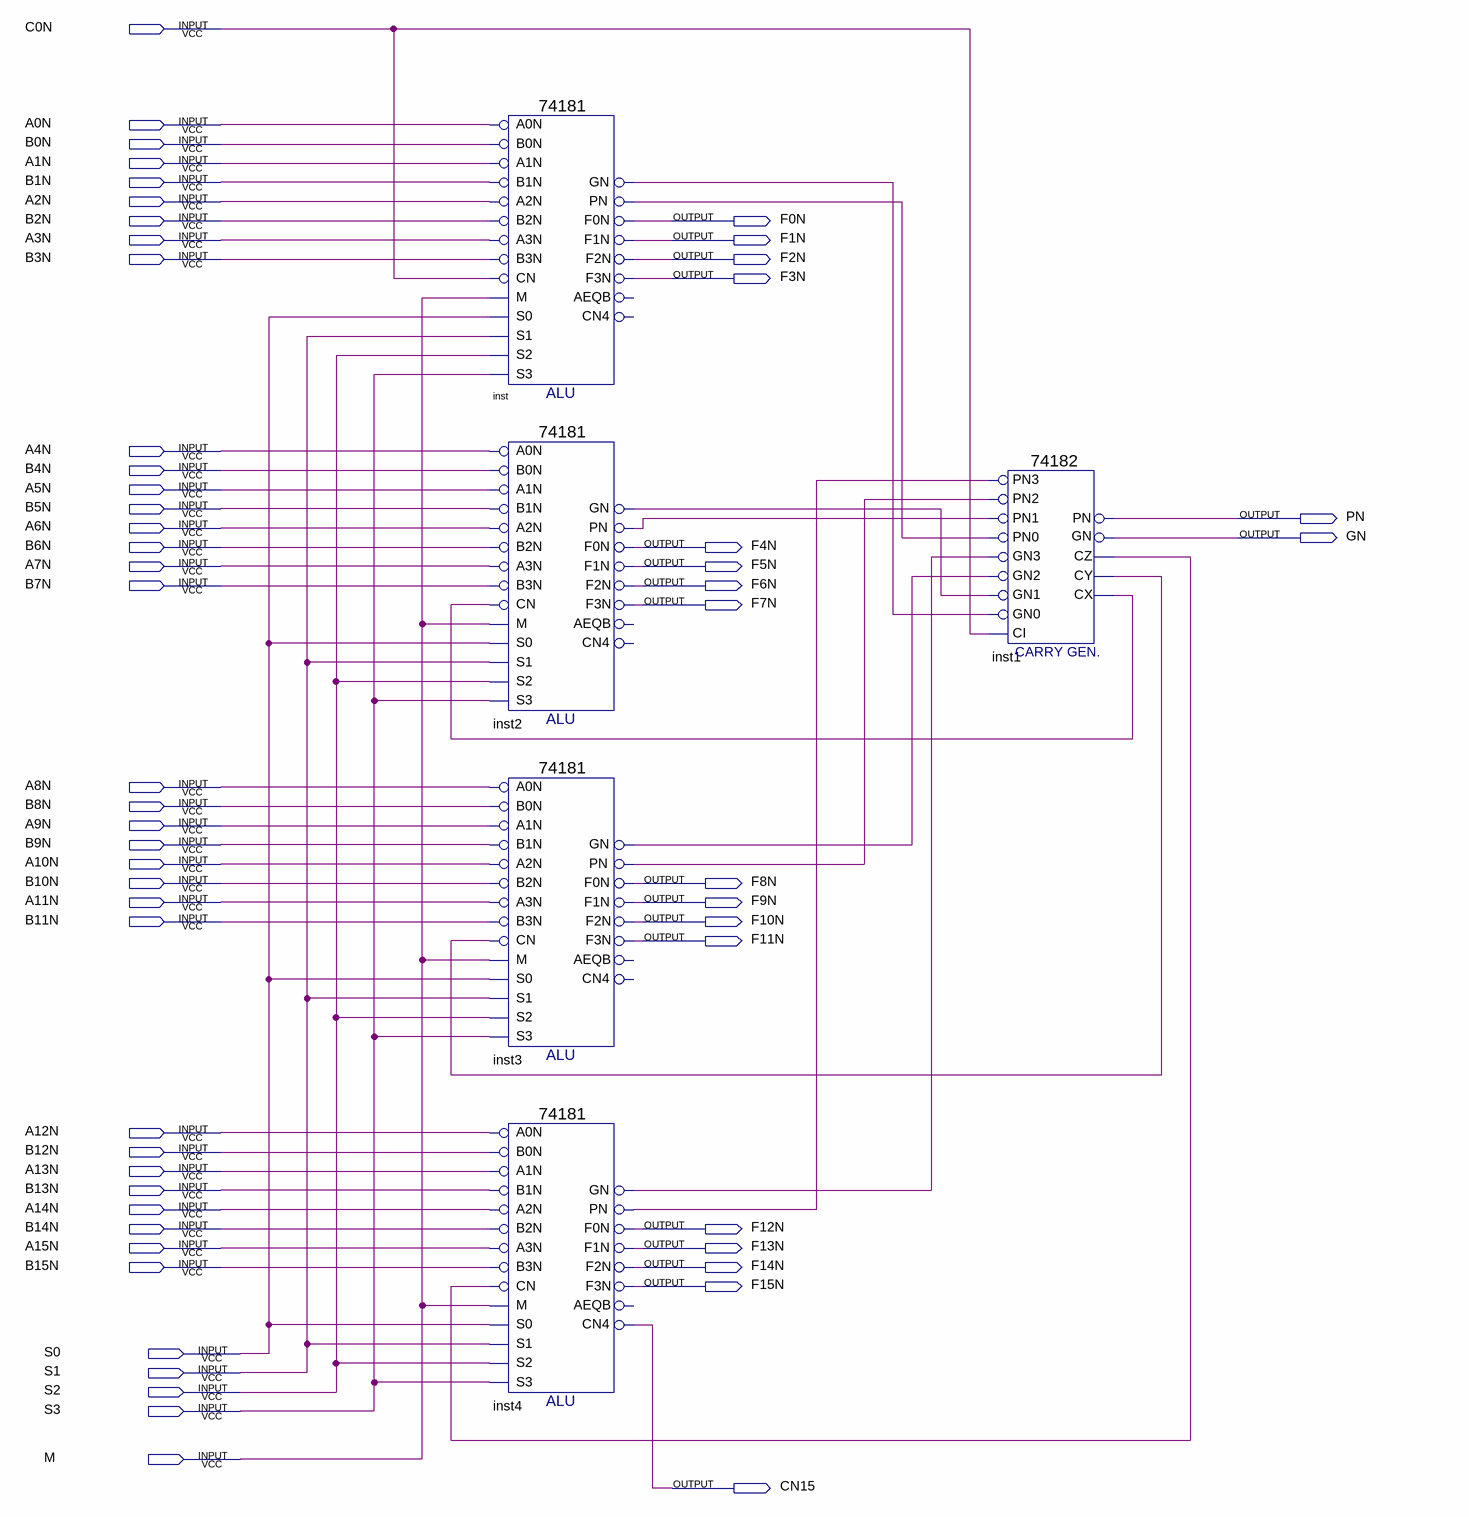
[diagram p0: schematic sheet]
// Quartus schematic ALU-16.bdf as structural Verilog: 5 symbols, 57 pins
module \ALU-16  (
  input  C0N,
  input  A0N,
  input  B0N,
  input  A1N,
  input  B1N,
  input  A2N,
  input  B2N,
  input  A3N,
  input  B3N,
  input  A4N,
  input  B4N,
  input  A5N,
  input  B5N,
  input  A6N,
  input  B6N,
  input  A7N,
  input  B7N,
  input  A8N,
  input  B8N,
  input  A9N,
  input  B9N,
  input  A10N,
  input  B10N,
  input  A11N,
  input  B11N,
  input  A12N,
  input  B12N,
  input  A13N,
  input  B13N,
  input  A14N,
  input  B14N,
  input  A15N,
  input  B15N,
  input  S0,
  input  S1,
  input  S2,
  input  S3,
  input  M,
  output F0N,
  output F1N,
  output F2N,
  output F3N,
  output PN,
  output GN,
  output F4N,
  output F5N,
  output F6N,
  output F7N,
  output F8N,
  output F9N,
  output F10N,
  output F11N,
  output F12N,
  output F13N,
  output F14N,
  output F15N,
  output CN15
);

  wire inst1_cx, inst1_cy, inst1_cz, inst2_gn, inst2_pn, inst3_gn, inst3_pn, inst4_gn, inst4_pn, inst_gn,
       inst_pn;

  \74181  inst (
    .B0N(B0N), .A0N(A0N), .A1N(A1N), .B1N(B1N), .A3N(A3N), .B2N(B2N), .A2N(A2N), .M(M), .CN(C0N), .B3N(B3N),
    .S2(S2), .S1(S1), .S0(S0), .S3(S3), .PN(inst_pn), .GN(inst_gn), .F3N(F3N), .F1N(F1N), .F0N(F0N), .F2N(F2N));  // open: AEQB, CN4
  \74181  inst2 (
    .B0N(B4N), .A0N(A4N), .A1N(A5N), .B1N(B5N), .A3N(A7N), .B2N(B6N), .A2N(A6N), .M(M), .CN(inst1_cx),
    .B3N(B7N), .S2(S2), .S1(S1), .S0(S0), .S3(S3), .PN(inst2_pn), .GN(inst2_gn), .F3N(F7N), .F1N(F5N),
    .F0N(F4N), .F2N(F6N));  // open: AEQB, CN4
  \74181  inst3 (
    .B0N(B8N), .A0N(A8N), .A1N(A9N), .B1N(B9N), .A3N(A11N), .B2N(B10N), .A2N(A10N), .M(M), .CN(inst1_cy),
    .B3N(B11N), .S2(S2), .S1(S1), .S0(S0), .S3(S3), .PN(inst3_pn), .GN(inst3_gn), .F3N(F11N), .F1N(F9N),
    .F0N(F8N), .F2N(F10N));  // open: AEQB, CN4
  \74181  inst4 (
    .B0N(B12N), .A0N(A12N), .A1N(A13N), .B1N(B13N), .A3N(A15N), .B2N(B14N), .A2N(A14N), .M(M), .CN(inst1_cz),
    .B3N(B15N), .S2(S2), .S1(S1), .S0(S0), .S3(S3), .PN(inst4_pn), .GN(inst4_gn), .F3N(F15N), .F1N(F13N),
    .F0N(F12N), .CN4(CN15), .F2N(F14N));  // open: AEQB
  \74182  inst1 (
    .PN2(inst3_pn), .GN2(inst3_gn), .GN3(inst4_gn), .PN3(inst4_pn), .CI(C0N), .PN1(inst2_pn), .PN0(inst_pn),
    .GN1(inst2_gn), .GN0(inst_gn), .CY(inst1_cy), .PN(PN), .CX(inst1_cx), .CZ(inst1_cz), .GN(GN));
endmodule
